# EAGLE design DB9_2_JST_GH (EAGLE 7.7.0)
Assembly variants: basic
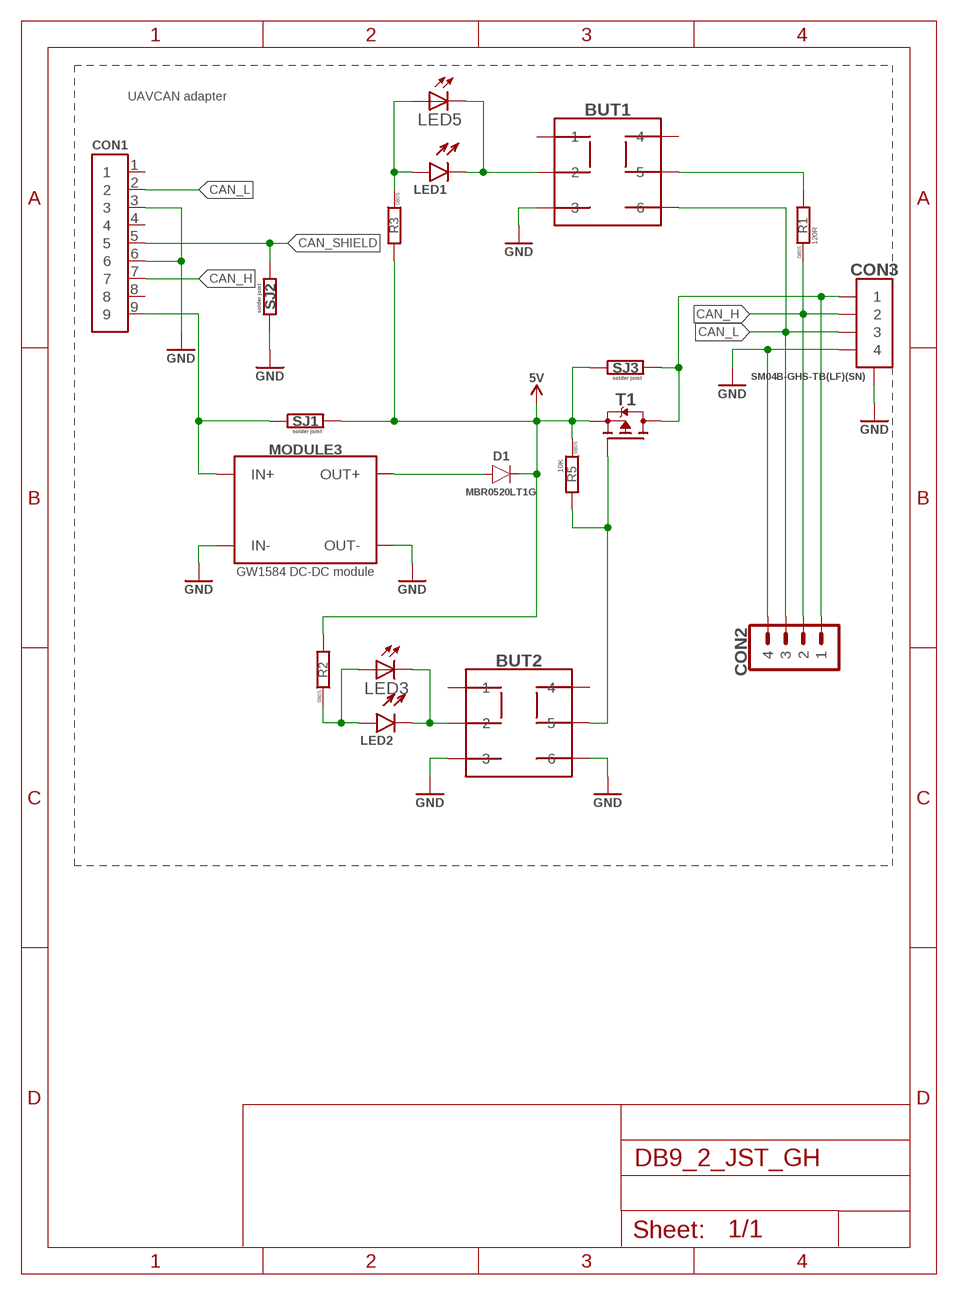
[diagram p0: schematic, sheet 1]

## Parts
BUT1  BUTTON  [PBM-0112]
BUT2  BUTTON  [PBM-0112]
CON1  DB9  [D_SUB9]
CON2  PINHEAD_1X04-2.54  [1X04-PTH-2.54]
CON3  CON-4P-JST_GH  [JST_GH-4P]
D1  MBR0520L-SOD123  [SOD123]
LED1  LED-0805  [LED0805]
LED2  LED-0805  [LED0805]
LED3  LED-3MM  [LED-3MM]  (not fitted in variant basic)
LED5  LED-3MM  [LED-3MM]  (not fitted in variant basic)
MODULE3  GW1584  [GW1584]
R1  120R  R-0805  [R0805]
R2  R-0805  [R0805]
R3  R-0805  [R0805]
R5  10K  R-0805  [R0805]
SJ1  SOLDER_JOINT_2P  [SJ_2P]
SJ2  SOLDER_JOINT_2P  [SJ_2P]
SJ3  SOLDER_JOINT_2P  [SJ_2P]
T1  FDN302P-SOT23  [SOT23B-3]

## Nets
CAN_H: CON1.7 CON2.2 CON3.2 R1.1
CAN_L: BUT1.6 CON1.2 CON2.3 CON3.3
CAN_PWR: CON1.9 MODULE3.IN+@1(IN+) MODULE3.IN+@2(IN+) SJ1.1
CAN_SHIELD: CON1.5 SJ2.1
CAN_VDD_EN: BUT2.5 R5.2 T1.G
GND: BUT1.3 BUT2.3 BUT2.6 CON1.3 CON1.6 CON2.4 CON3.4 CON3.M$0(GND) CON3.M$1(GND) MODULE3.IN-@1(IN-) MODULE3.IN-@2(IN-) MODULE3.OUT-@1(OUT-) MODULE3.OUT-@2(OUT-) SJ2.2
N$1: BUT2.2 LED2.C LED3.K(C)
N$2: BUT1.5 R1.2
N$3: BUT1.2 LED1.C LED5.K(C)
N$5: LED1.A LED5.A R3.1
N$6: D1.A MODULE3.OUT+@1(OUT+) MODULE3.OUT+@2(OUT+)
N$7: CON2.1 CON3.1 SJ3.2 T1.D
N$8: LED2.A LED3.A R2.1
VDD_5V: D1.C R2.2 R3.2 R5.1 SJ1.2 SJ3.1 T1.S ; supply symbol labelled 5V
Unconnected: BUT1.1 BUT1.4 BUT2.1 BUT2.4 CON1.1 CON1.4 CON1.8

## Notes on the sheet
- UAVCAN adapter

## Library data of the parts
BUT1 BUT2 = masterlib:BUTTON; CHIPDIP: https://www.chipdip.ru/product/b170k
CON1 = masterlib:DB9
CON2 = pinhead:PINHEAD_1X04
CON3 = Connectors:CON-4P: Connector Receptacle 4 Position 0.049" (1.25mm) Tin Surface Mount, Right Angle; DIGIKEY#: 455-1566-1-ND; MANF: JST Sales America Inc; MANF#: SM04B-GHS-TB(LF)(SN); PITCH: 1.25mm
D1 = Diodes:MBR0520L: DIODE SCHOTTKY 20V 500MA SOD123; DIGIKEY#: MBR0520LT1GOSTR-ND; MANF: ON Semiconductor; MANF#: MBR0520LT1G
LED1 = rc:LED: SMD LED; COLOR: RED
LED2 = rc:LED: SMD LED; COLOR: YELLOW
LED3 LED5 = dp_devices:LED: Light Emitting Diode; ASSEMBLY: SPECIAL; BOM: OPTIONAL; COLOR: RED; LINK: http://www.zip-2002.ru/osveshchenie_i_indikatsiya/svetodiody/86349/1x3x4_red_50_mcd_2,1v/
MODULE3 = ali_modules:GW1584: THIS http://mysku.ru/blog/aliexpress/35938.html http://ru.aliexpress.com/item/New-Mini-Converter-Adjustable-DC-DC-Step-down-Power-Supply-Module-replace-LM2596/32411413046.html?spm=2114.30010708.3.314.AhmzLw&s=p&ws_ab_test=searchweb201556_6,searchweb201602_5_10017_10010_10011_10018_10019_10036_10035_10034_301_507_10033_10032_10020_10001_10002_10005_10006_10021_10003_10022_10004_401_10009_10007_10008_2030013,searchweb201603_9&btsid=8a54b1af-cc82-4f8d-a784-d3b67147a089
R1-R3 R5 = rc:R; PACKAGE: 0805
SJ1-SJ3 = misc:SOLDER_JOINT_2P; BOM: EXCLUDE
T1 = usb2can_master_lib:FDN302P: MOSFET P-CH 20V 2.4A SOT-23; DIGIKEY#: FDN302PCT-ND; MANF: Fairchild Semiconductor; MANF#: FDN302P

## Board
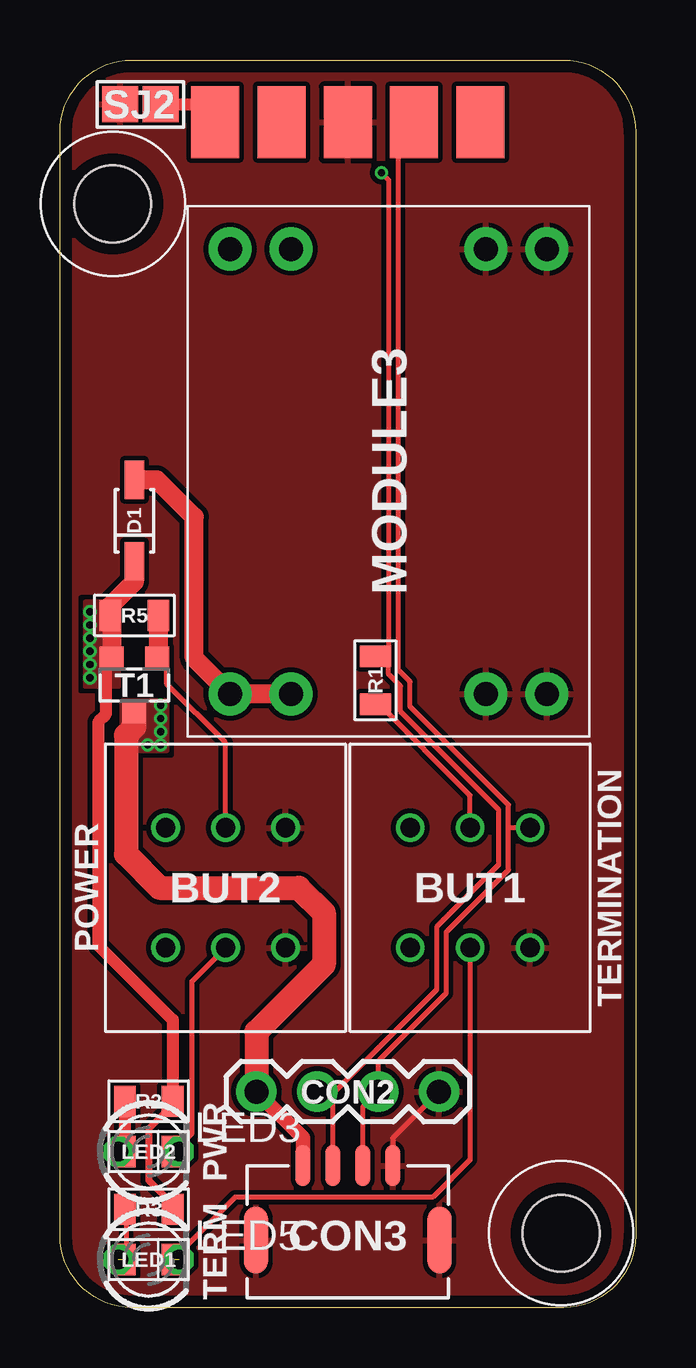
[diagram p1: board, top side]
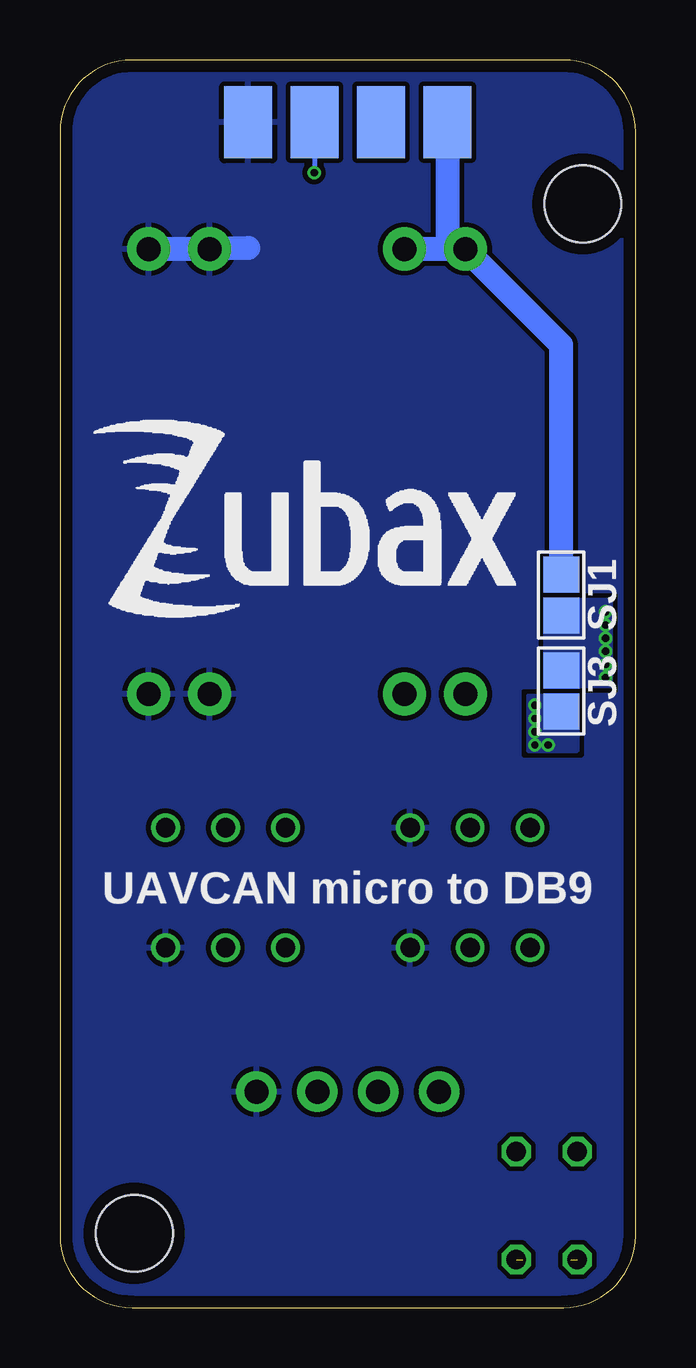
[diagram p2: board, bottom side, seen from below]

Size 24 x 52 mm. Coordinates in mm from the lower left corner, seen from the top.
Outline: 0,3 0,49 arc-90 3,52 21,52 arc-90 24,49 24,3 arc-90 21,0 3,0 arc-90 0,3
Copper layers (1*16): Top 0.035mm / dielectric 0.5mm / Bottom 0.035mm
Design rules "usb2can_drc": minimum track width 0.2mm, minimum drill 0.2mm, track to track 0.2mm, track to pad 0.2mm, pad to pad 0.2mm, via to via 0.2mm, smd to smd 0.15mm, copper to edge 0.5mm, drill to drill 0.2mm, minimum pad ring 0.125mm, minimum via ring 0.125mm, stop-mask expansion 1mil, vias tented up to drill 0.31mm, thermal gap 8mil
Holes 3.2 mm at 2.2,46 20.9,3.1

### Footprints (pad centres in the part's own frame; a part is rotated, then mirrored left to right if it is on the bottom)
PBM-0112 = drill 0.8: 1 -2.5,2.5; 2 -2.5,0; 3 -2.5,-2.5; 4 2.5,2.5; 5 2.5,0; 6 2.5,-2.5
D_SUB9 = smd 2 x 3: 1 -5.54,0; 2 -2.77,0; 3 0,0; 4 2.77,0; 5 5.54,0 | smd 2 x 3 bottom: 6 -4.155,0; 7 -1.385,0; 8 1.385,0; 9 4.155,0
1X04-PTH-2.54 = drill 1 pad 1.7: 1 -3.81,0; 2 -1.27,0; 3 1.27,0; 4 3.81,0
JST_GH-4P = smd 0.6 x 1.7: 1 1.875,-2.91; 2 0.625,-2.91; 3 -0.625,-2.91; 4 -1.875,-2.91 | smd 1 x 2.8: M$0 -3.825,0.19; M$1 3.825,0.19
SOD123 = smd 1.6 x 0.8: A 1.7,0; C -1.7,0
LED0805 = smd 0.9 x 1.3: A -1,0; C 1,0
LED-3MM = drill 0.813 octagon: A -1.27,0; K 1.27,0
GW1584 = drill 1 pad 1.8: IN+@1 9.271,6.604; IN+@2 9.271,4.064; IN-@1 9.271,-6.604; IN-@2 9.271,-4.064; OUT+@1 -9.271,6.604; OUT+@2 -9.271,4.064; OUT-@1 -9.271,-4.064; OUT-@2 -9.271,-6.604
R0805 = smd 0.9 x 1.3: 1 -1,0; 2 1,0
SJ_2P = smd 1.5 x 1.5: 1 -0.85,0; 2 0.85,0
SOT23B-3 = smd 1 x 1: D 0,1.1; G -0.95,-1.1; S 0.95,-1.1

### Placement (x,y rotation side)
BUT1  17.1,17.5 90 top
BUT2  6.9,17.5 90 top
CON1  12,49.4 180 top
CON2  12,9 0 top
CON3  12,3 180 top
D1  3.1,32.8 90 top
LED1  3.7,2 0 top
LED2  3.7,6.5 0 top
LED3  3.7,6.5 0 top  (not fitted)
LED5  3.7,2 0 top  (not fitted)
MODULE3  13.7,34.85 90 top
R1  13.15,26.15 270 top
R2  3.7,8.6 0 top
R3  3.7,4.1 0 top
R5  3.1,28.85 0 top
SJ1  3.1,29.7 270 bottom
SJ2  3.35,50.15 180 top
SJ3  3.1,25.7 270 bottom
T1  3.1,25.95 180 top
U$13  [ZUBAX_LOGO_18X8]  13.15,32 0 bottom

### Tracks (layer width: path | path; a pad name or v marks a point on that pad's centre or on a via)
CAN_H  (via drill 0.3)
  Top 0.2: v13.4,47.3 13.7,47 13.7,27 | CON3.2 11.38,8.93 | 13.7,27 12.95,27 12.95,27.15 R1.1 | 13.7,27 13.7,26.4 14.2,25.9 14.2,24.85 18.3,20.75 18.3,18.46 15.7,15.86 15.7,13.25 11.38,8.93 | CON2.2 10.8,8.93 11.38,8.93
  Bottom 0.2: CON1.7 13.38,47.31 v13.4,47.3
CAN_L
  Top 0.2: CON1.2 14.1,48.73 14.1,26.59 14.6,26.09 14.6,25.05 18.7,20.95 18.7,20 | CON3.3 12.62,8.36 CON2.3 13.27,10.27 16.1,13.1 16.1,15.64 18.7,18.24 18.7,20 | BUT1.6 18.7,20
CAN_PWR
  Bottom 1: SJ1.1 3.1,40.12 MODULE3.IN+@1 7.85,44.12 | 7.85,44.12 MODULE3.IN+@2 | CON1.9 7.84,44.13 7.85,44.12
CAN_SHIELD
  Top 0.5: SJ2.1 5.71,50.15 CON1.5
CAN_VDD_EN
  Top 0.2: BUT2.5 6.9,23.55 4.45,26 4.45,26.6 4.05,27 T1.G
  Top 0.8: R5.2 4.1,27.05 T1.G
GND
  Top 0.2: 12,48.8 CON1.3 | CON2.4 13.88,7.06 CON3.4
  Bottom 1: MODULE3.IN-@1 MODULE3.IN-@2 16.16,44.16
  pour Bottom (rank 5): 0,52 24,52 24,0 0,0
  pour Top (rank 5): 0,52 24,52 24,0 0,0
N$1
  Top 0.2: BUT2.2 5.5,13.6 5.5,7.25 4.86,6.61
  Top 0.5: LED2.C 4.7,6.77 4.86,6.61 LED3.K
N$2
  Top 0.2: BUT1.5 17.1,21.35 13.3,25.15 R1.2
N$3  (1 unrouted)
  Top 0.2: BUT1.2 17.1,6.15 15.55,4.6 7.3,4.6 4.97,2.27 LED5.K
N$5  (1 unrouted)
  Top 0.2: R3.1 2.75,4.05 2.75,1.8 2.7,1.85 LED1.A
N$6
  Top 0.8: MODULE3.OUT+@2 MODULE3.OUT+@1 5.6,27.07 5.6,32.95 4.05,34.5 D1.A
N$7  (via drill 0.3)
  Top 0.6: CON3.1 10.12,7.06 CON2.1
  Top 1: SJ3.2 3.1,24.2 2.75,23.85 2.75,18.9 4.15,17.5 9.95,17.5 11,16.45 11,14.3 8.19,11.49 CON2.1
  other vias: 4.2,25.1 4.2,24.55 4.2,24 4.2,23.45 3.65,23.45
  pour Top (no thermals): 2.6,25.3 4.45,25.3 4.45,23.2 2.6,23.2
  pour Bottom (no thermals): 4.45,25.5 2.45,25.5 2.45,23.2 4.45,23.2
N$8
  Top 0.5: R2.1 LED2.A 2.7,6.77 LED3.A
VDD_5V  (via drill 0.3)
  Top 0.3: R2.2 4.7,8.45 3.7,7.45 3.7,5.3 4.7,4.3 R3.2
  Top 0.5: T1.S 1.9,26.8 1.9,24.7 1.6,24.4 1.6,15.1 4.7,12 R2.2
  Top 0.8: D1.C 3.1,30.25 2.05,29.2 2.05,28.7 | 2.05,28.7 2.1,28.75 R5.1 | 2.05,28.7 2.15,28.6 T1.S
  other vias: 1.25,29 1.25,28.45 1.25,27.9 1.25,27.35 1.25,26.8 1.25,26.25
  pour Bottom (no thermals): 3.75,29.5 1.05,29.5 1.05,25.9 3.75,25.9
  pour Top (no thermals): 2.45,29.4 1.05,29.4 1.05,25.9 2.45,25.9

### Text on the board
tPlace: POWER | TERMINATION | PWR | TERM
bPlace: UAVCAN micro to DB9